# Altium project so do nguyen lí bao chay khong day.PrjPcb
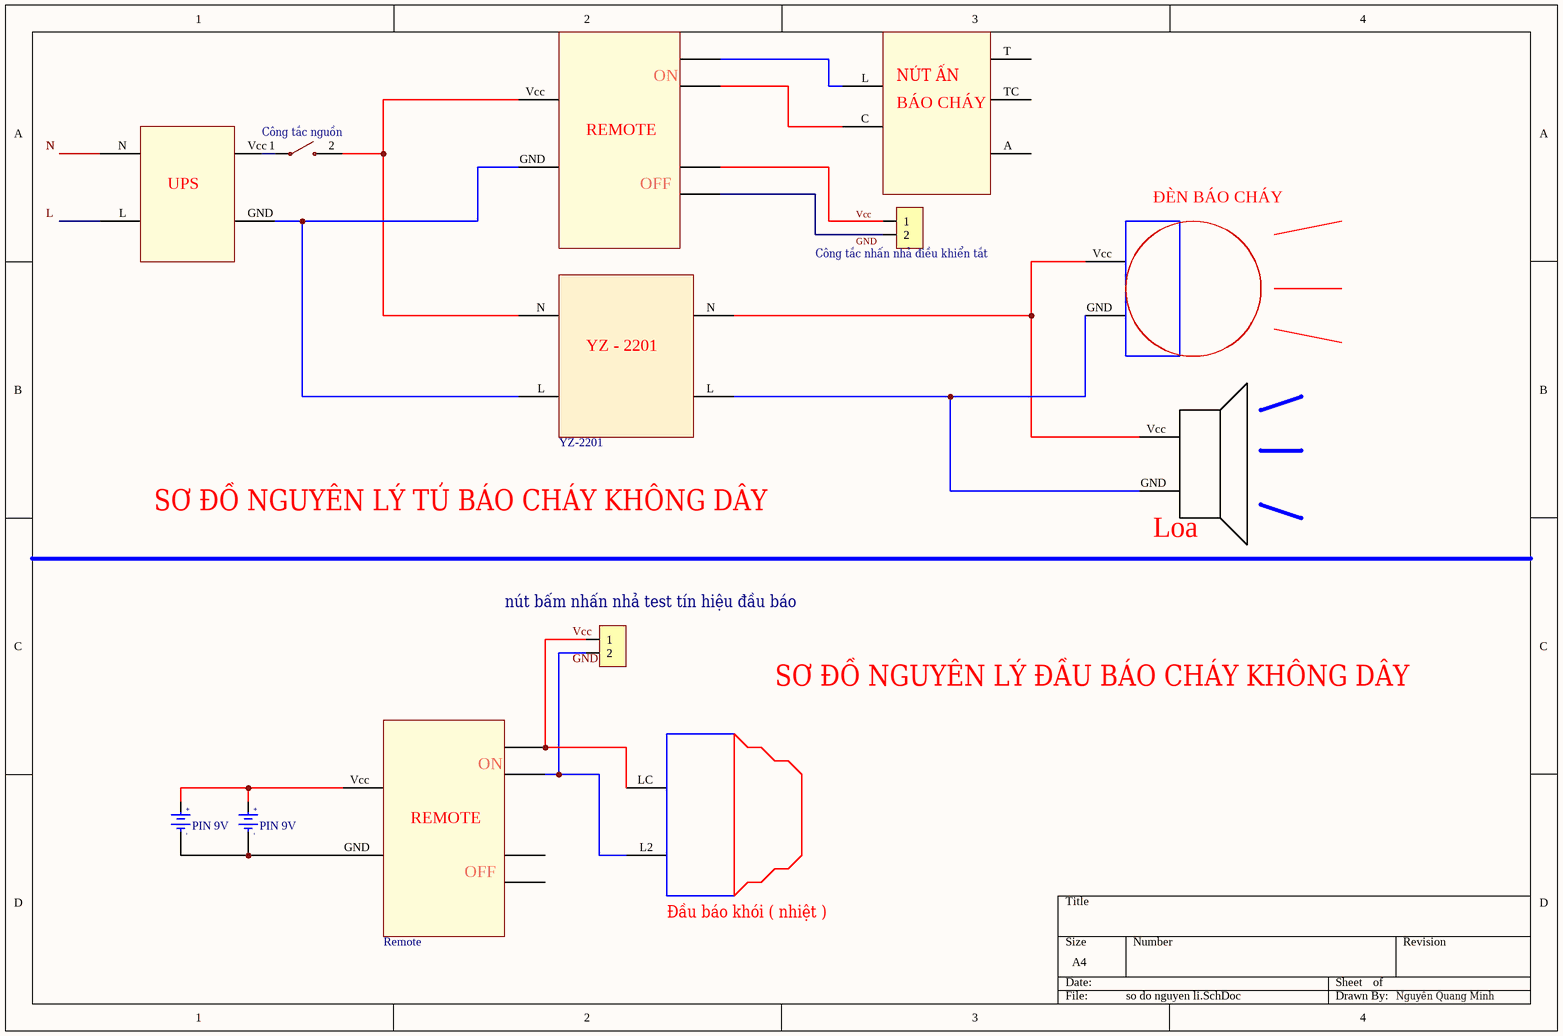
[diagram p0: so do nguyen li.SchDoc]
2 sheets, 18 parts. Net scope: global (net labels, ports and power ports of the same name join across sheets).
Sheets:
  so do nguyen li.SchDoc
  so do nguyen li dau bao khoi_nhiet.SchDoc

## Sheet so do nguyen li.SchDoc: *Nguyễn Quang Minh
size A4; SheetNumber: 1; SheetTotal: 2

### Parts
(Parts that share a designator on the sheet are numbered #1, #2 ... from top to bottom, then left to right.)
*#1  nut nhan bao chay  (value not drawn)
*#2  Remote  (value not drawn)
*#3  YZ-2201  (value not drawn)
*#4  Den  (value not drawn)
*#5  YZ-2201
*#6  Loa
*?#1  dau bao khoai hoac nhiet  (value not drawn)
*?#2  Remote
BT?#1  PIN 9V  [PIN3V]
BT?#2  PIN 9V  [PIN3V]
Công_tắc  Công tắc nguồn  [PUSH_BUTTON_SMD_3X4X2]
JP?#1  Công tắc nhấn nhả điều khiển tắt  [JP 1x2 CC]
JP?#2  nút bấm nhấn nhả test tín hiệu đầu báo  [JP 1x2 CC]

### Nets
Vcc: *#2.40 *?#1.LC *?#2.38 JP?#1.1 JP?#2.1
Net*#1_C: *#1.C *#2.39
Net*#1_L: *#1.L *#2.38
Net*#2_41: *#2.41 JP?#1.2
Net*#2_GND: *#2.GND *#3.GND *#5.L
Net*#2_Vcc: *#2.Vcc *#5.N Công_tắc.2
Net*#3_Vcc: *#3.Vcc Công_tắc.1
Net*#4_GND: *#4.GND *#5.L *#6.GND
Net*#4_Vcc: *#4.Vcc *#5.N *#6.Vcc
Net*?#1_L2: *?#1.L2 *?#2.39 JP?#2.2
Net*?#2_GND: *?#2.GND BT?#1.2(GND) BT?#2.2(GND)
Net*?#2_Vcc: *?#2.Vcc BT?#1.1(+3V) BT?#2.1(+3V)

Not connected (* = marked no-connect by the designer): *#1 A(48) T(46) TC(47); *#3 L N; *?#2 40 41

### Notes on the sheet
- SƠ ĐỒ NGUYÊN LÝ TỦ BÁO CHÁY KHÔNG DÂY
- SƠ ĐỒ NGUYÊN LÝ ĐẦU BÁO CHÁY KHÔNG DÂY
- Nguyễn Quang Minh
- Labels drawn without touching a wire or pin: GND, L
- (in symbol dau bao khoai hoac nhiet) Đầu báo khói ( nhiệt )
- (in symbol Den) ĐÈN BÁO CHÁY
- (in symbol nut nhan bao chay) NÚT ẤN; BÁO CHÁY
- (in symbol PIN 3V) +; -
- (in symbol Remote) ON; REMOTE; OFF
- (in symbol YZ-2201) YZ - 2201

### Library data of the parts
*#3 = UPS
BT?#1 BT?#2 = PIN 3V: Battery 3VDC; Value: PIN 3V
Công_tắc = PUSH_BUTTON_SMD_3X4X2: Push Button Tactile Switch SMD 2 Pins 3x4x2mm.; JLCPCB PN: C231644
JP?#1 JP?#2 = JP 1x2 2.54 Cai Cong: Cắm; Ten_Linh_Kien: Jump Đơn Cái 2.54MM 1x40P Cong; Don_Vi: Con; Ma_Hang: MH001265; Ghi_Chu: *; Kieu_Chan: *; Chung_Loai: Cắm

## Sheet so do nguyen li dau bao khoi_nhiet.SchDoc
size A4; SheetNumber: 2; SheetTotal: 2
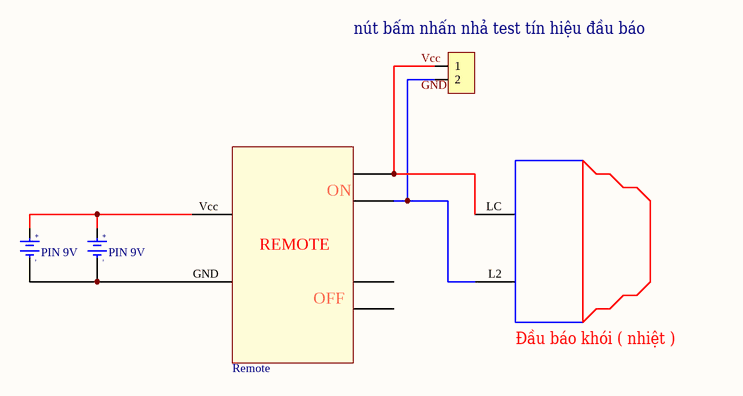
[diagram p1: so do nguyen li dau bao khoi_nhiet.SchDoc]

### Parts
(Parts that share a designator on the sheet are numbered #1, #2 ... from top to bottom, then left to right.)
*#7  dau bao khoai hoac nhiet  (value not drawn)
*#8  Remote
BT?#3  PIN 9V  [PIN3V]
BT?#4  PIN 9V  [PIN3V]
JP?#3  nút bấm nhấn nhả test tín hiệu đầu báo  [JP 1x2 CC]

### Nets
Vcc: *#7.LC *#8.38 JP?#3.1
Net*#7_L2: *#7.L2 *#8.39 JP?#3.2
Net*#8_GND: *#8.GND BT?#3.2(GND) BT?#4.2(GND)
Net*#8_Vcc: *#8.Vcc BT?#3.1(+3V) BT?#4.1(+3V)

Not connected (* = marked no-connect by the designer): *#8 40 41

### Notes on the sheet
- Labels drawn without touching a wire or pin: GND
- (in symbol dau bao khoai hoac nhiet) Đầu báo khói ( nhiệt )
- (in symbol PIN 3V) +; -
- (in symbol Remote) ON; REMOTE; OFF

### Library data of the parts
BT?#3 BT?#4 = PIN 3V: Battery 3VDC; Value: PIN 3V
JP?#3 = JP 1x2 2.54 Cai Cong: as JP?#1 on sheet so do nguyen li; Ghi_Chu: *; Kieu_Chan: *; Chung_Loai: Cắm

## Nets that join several sheets
Vcc: so do nguyen li (5 pins), so do nguyen li dau bao khoi_nhiet (*#7.LC *#8.38 JP?#3.1)